# EAGLE design test (EAGLE 6.6.0)
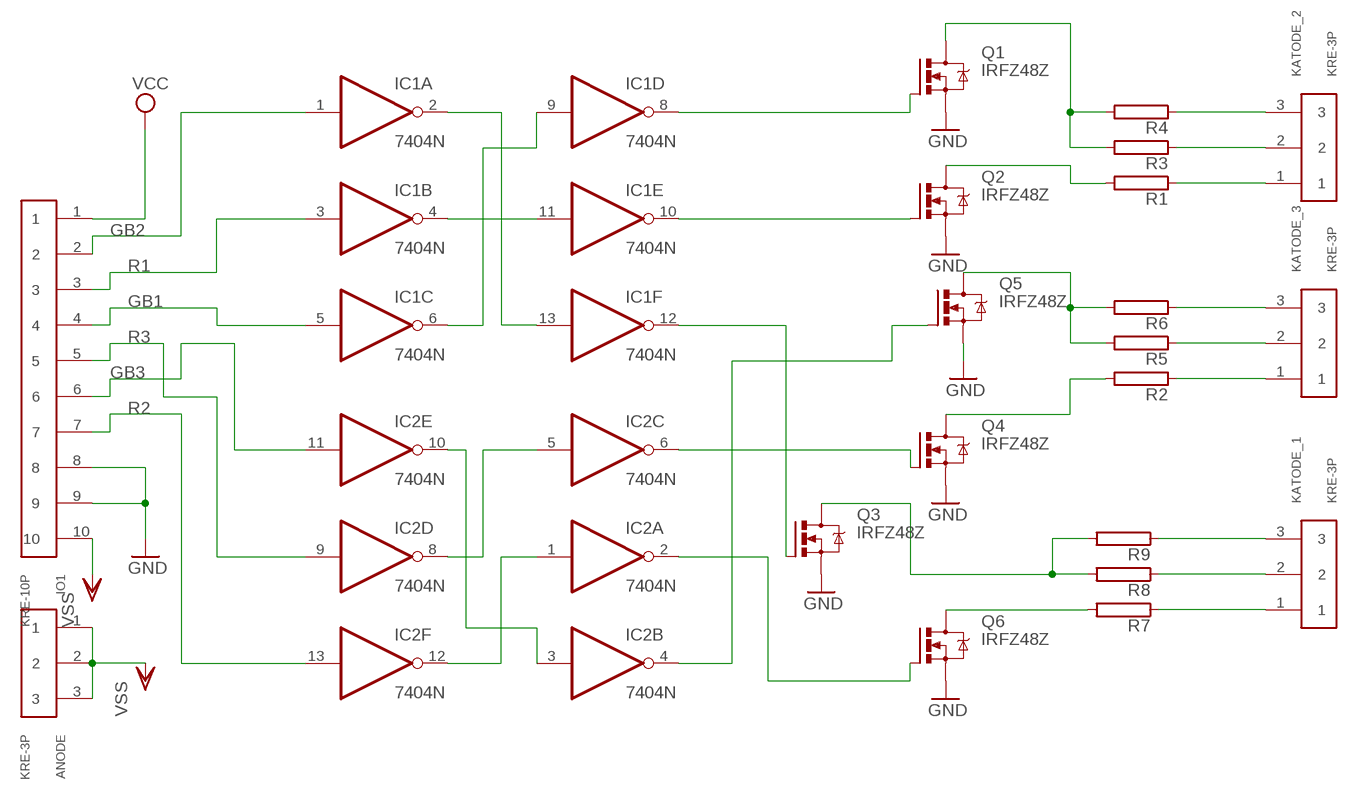
[diagram p0: schematic, sheet 1]

## Parts
ANODE  KRE-3P  [KRE-3P]
IC1  7404N  [DIL14]
IC2  7404N  [DIL14]
IO1  KRE-10P  [KRE-10P]
KATODE_1  KRE-3P  [KRE-3P]
KATODE_2  KRE-3P  [KRE-3P]
KATODE_3  KRE-3P  [KRE-3P]
Q1  IRFZ48Z  [TO220BH]
Q2  IRFZ48Z  [TO220BH]
Q3  IRFZ48Z  [TO220BH]
Q4  IRFZ48Z  [TO220BH]
Q5  IRFZ48Z  [TO220BH]
Q6  IRFZ48Z  [TO220BH]
R1  RAC10  [AC10]
R2  RAC10  [AC10]
R3  RAC10  [AC10]
R4  RAC10  [AC10]
R5  RAC10  [AC10]
R6  RAC10  [AC10]
R7  RAC10  [AC10]
R8  RAC10  [AC10]
R9  RAC10  [AC10]

## Nets
GB1: IC1.5(C:I) IO1.4
GB2: IC1.1(A:I) IO1.2
GB3: IC2.11(E:I) IO1.6
GND: IO1.8 IO1.9 Q1.S Q2.S Q3.S Q4.S Q5.S Q6.S
K_B: Q2.D R1.2
K_B2: Q5.D R5.2 R6.2
K_R: Q1.D R3.2 R4.2
N$1: IC1.8(D:O) Q1.G
N$2: IC1.10(E:O) Q2.G
N$3: KATODE_2.1 R1.1
N$4: IC1.12(F:O) Q3.G
N$5: IC1.4(B:O) IC1.11(E:I)
N$6: IC2.1(A:I) IC2.12(F:O)
N$7: IC2.5(C:I) IC2.8(D:O)
N$8: IC2.6(C:O) Q4.G
N$9: IC2.2(A:O) Q6.G
N$10: IC2.4(B:O) Q5.G
N$11: IC2.3(B:I) IC2.10(E:O)
N$12: IC1.6(C:O) IC1.9(D:I)
N$13: KATODE_2.2 R3.1
N$14: KATODE_2.3 R4.1
N$21: IC1.2(A:O) IC1.13(F:I)
N$22: KATODE_3.1 R2.1
N$23: KATODE_3.2 R5.1
N$24: KATODE_3.3 R6.1
N$25: KATODE_1.1 R7.1
N$26: KATODE_1.2 R8.1
N$27: KATODE_1.3 R9.1
N$28: Q3.D R8.2 R9.2
N$29: Q6.D R7.2
N$30: Q4.D R2.2
R1: IC1.3(B:I) IO1.3
R2: IC2.13(F:I) IO1.7
R3: IC2.9(D:I) IO1.5
VCC: IO1.1
VSS: ANODE.1 ANODE.2 ANODE.3 IO1.10

## Power pins joined to a net without a drawn wire
GND: IC1.7(P:GND) IC2.7(P:GND)
VCC: IC1.14(P:VCC) IC2.14(P:VCC)

## Library data of the parts
ANODE KATODE_1-KATODE_3 = kre:KRE-3P: KRE Conector 3P
IC1 IC2 = 74xx-eu:74*04: Hex INVERTER
IO1 = kre:KRE-10P: KRE Conector 10P
Q1-Q6 = transistor-power:IRFZ48: N Channel HEXFET® Power MOSFET Logic Level Source: http://www.irf.com/product-info/datasheets/data/irfz48z.pdf
R1-R9 = resistor-power:R: Power Resitor; OC_FARNELL: unknown; OC_NEWARK: unknown

## Net classes
0 default: clearance 0.205 mm

## Board
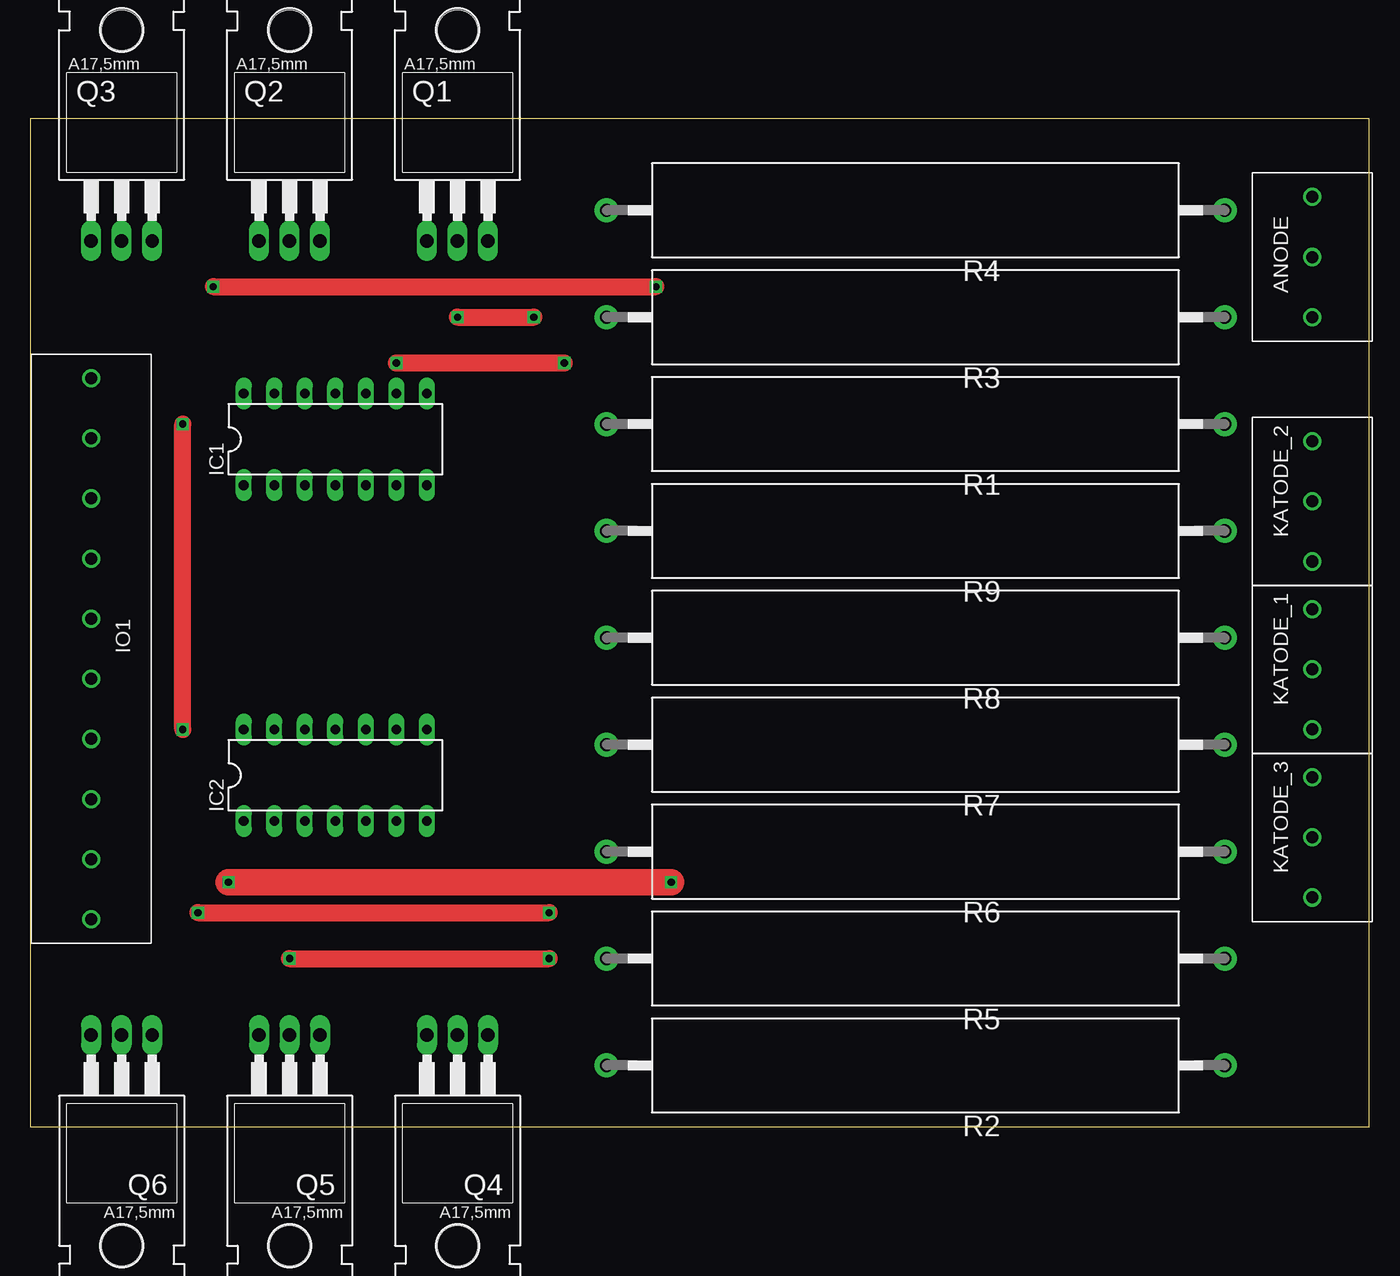
[diagram p1: board, top side]
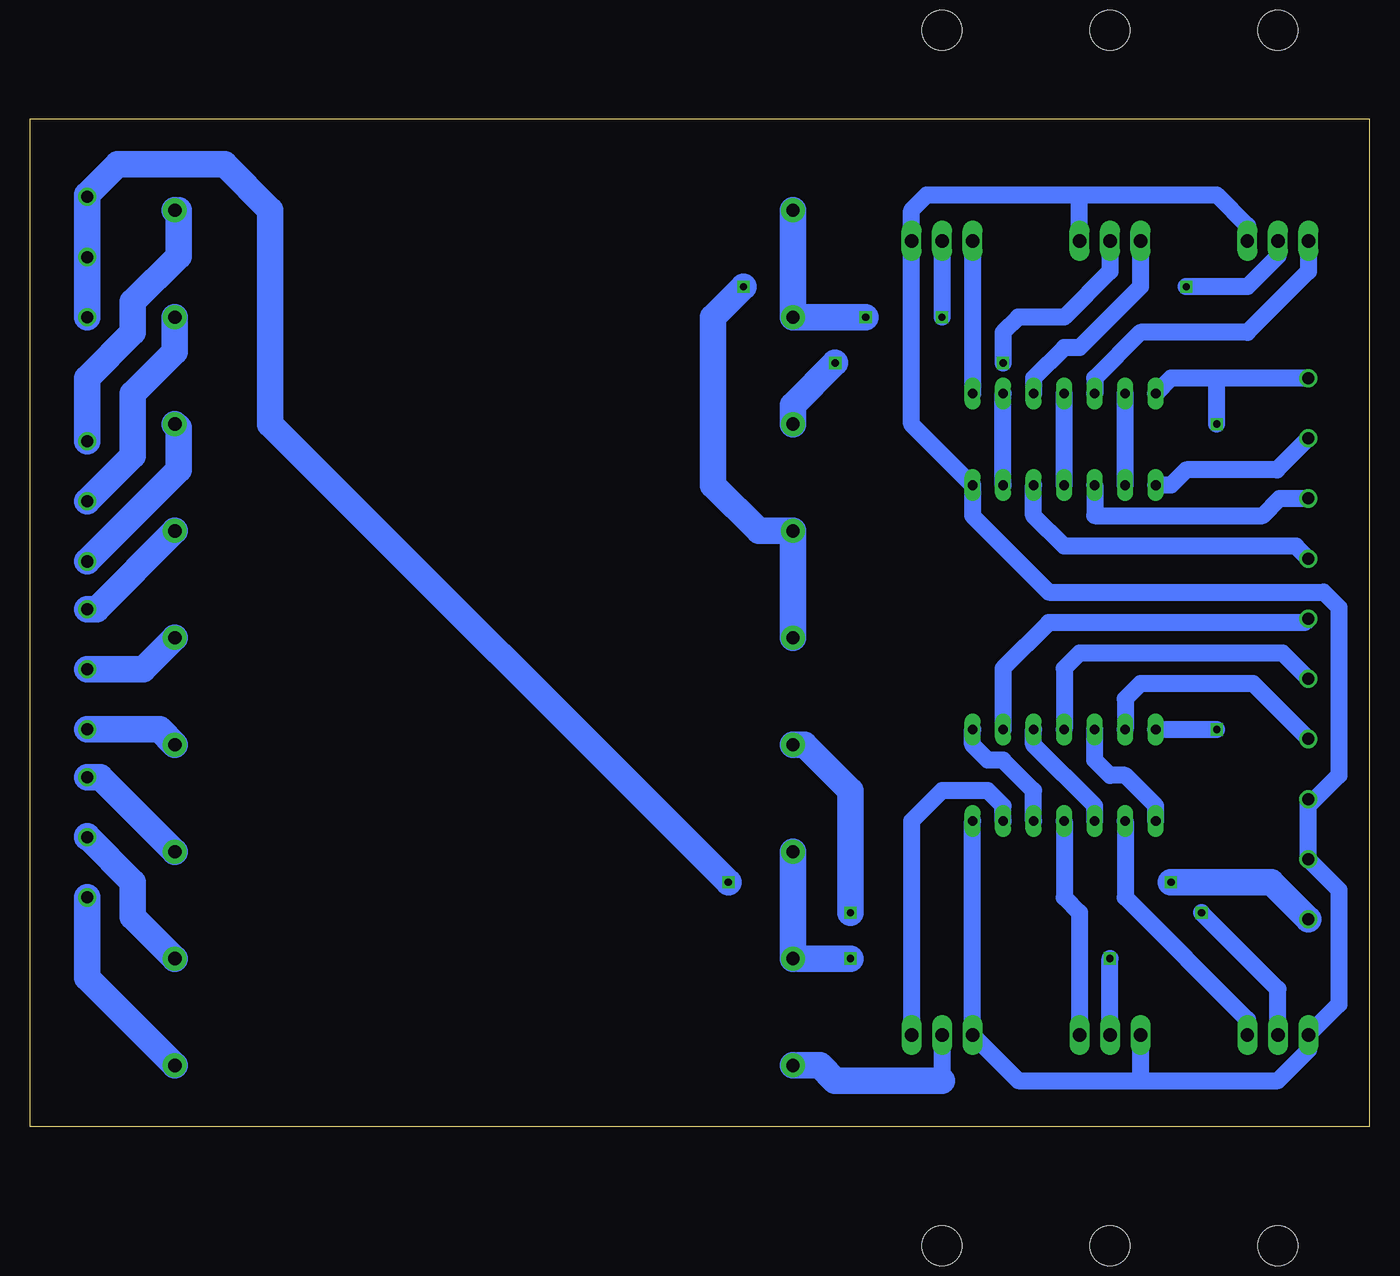
[diagram p2: board, bottom side, seen from below]

Size 111.43 x 83.81 mm. Coordinates in mm from the lower left corner, seen from the top.
Outline: 0,0 111.43,0 111.43,83.81 0,83.81 0,0
Copper layers (1*16): Top 0.035mm / dielectric 1.5mm / Bottom 0.035mm
Design rules "default": minimum track width 10mil, minimum drill 24mil, track to track 8mil, track to pad 8mil, pad to pad 8mil, via to via 8mil, smd to smd 8mil, copper to edge 40mil, drill to drill 8mil, minimum pad ring 10mil, minimum via ring 8mil, stop-mask expansion 4mil, vias tented up to drill 0mil, thermal gap 10mil

### Footprints (pad centres in the part's own frame; a part is rotated, then mirrored left to right if it is on the bottom)
KRE-3P = drill 1: 1 -5.08,0; 2 -0.08,0; 3 4.92,0
DIL14 = drill 0.813 long: 1 -7.62,-3.81; 2 -5.08,-3.81; 3 -2.54,-3.81; 4 0,-3.81; 5 2.54,-3.81; 6 5.08,-3.81; 7 7.62,-3.81; 8 7.62,3.81; 9 5.08,3.81; 10 2.54,3.81; 11 0,3.81; 12 -2.54,3.81; 13 -5.08,3.81; 14 -7.62,3.81
KRE-10P = drill 1: 1 -20.32,0; 2 -15.32,0; 3 -10.32,0; 4 -5.32,0; 5 -0.32,0; 6 4.68,0; 7 9.68,0; 8 14.68,0; 9 19.68,0; 10 24.68,0
TO220BH = drill 1.118 long: D 0,-6.35; G -2.54,-6.35; S 2.54,-6.35 | hole 3.302: 0,11.176
AC10 = drill 1.1 pad 2: 1 -25.725,0; 2 25.7,0

### Placement (x,y rotation side)
ANODE  106.68,72.39 90 top
IC1  25.4,57.15 0 top
IC2  25.4,29.21 0 top
IO1  5.08,41.91 270 top
KATODE_1  106.68,38.1 90 top
KATODE_2  106.68,52.07 90 top
KATODE_3  106.68,24.13 90 top
Q1  35.56,80.01 0 top
Q2  21.59,80.01 0 top
Q3  7.62,80.01 0 top
Q4  35.56,1.27 180 top
Q5  21.59,1.27 180 top
Q6  7.62,1.27 180 top
R1  73.66,58.42 180 top
R2  73.66,5.08 180 top
R3  73.66,67.31 180 top
R4  73.66,76.2 180 top
R5  73.66,13.97 180 top
R6  73.66,22.86 180 top
R7  73.66,31.75 180 top
R8  73.66,40.64 180 top
R9  73.66,49.53 180 top

### Tracks (layer width: path | path; a pad name or v marks a point on that pad's centre or on a via)
GB1
  Bottom 1.422: IO1.4 6.11,48.26 25.4,48.26 27.94,50.8 IC1.5
GB2
  Bottom 1.422: IO1.2 7.7,54.61 15.24,54.61 16.51,53.34 IC1.1
GB3
  Bottom 1.422: IO1.6 7.22,39.37 24.13,39.37 25.4,38.1 IC2.11
GND
  Bottom 1.422: 19.05,3.81 29.21,3.81 Q4.S IC2.7 | 19.05,3.81 7.62,3.81 5.08,6.35 Q6.S 2.54,10.16 2.54,19.69 IO1.9 5.08,26.67 | Q5.S 19.05,3.81 | 5.08,26.67 IO1.8 | 24.13,77.47 36.83,77.47 38.1,76.2 Q1.S 38.1,58.42 IC1.7 33.02,50.8 26.67,44.45 3.81,44.45 2.54,43.18 2.54,29.21 5.08,26.67 | 24.13,77.47 12.7,77.47 10.16,74.93 Q3.S | Q2.S 24.13,77.47
K_B  (via drill 0.6)
  Top 1.422: v30.48,63.5 v44.45,63.5
  Bottom 1.422: Q2.D 21.59,71.12 25.4,67.31 29.21,67.31 30.48,66.04 v30.48,63.5
  Bottom 2.184: v44.45,63.5 47.96,59.99 R1.2
K_B2  (via drill 0.6)
  Top 1.422: v21.59,13.97 v43.18,13.97
  Bottom 1.422: Q5.D v21.59,13.97
  Bottom 2.184: R6.2 R5.2 v43.18,13.97
K_R  (via drill 0.6)
  Top 1.422: v35.56,67.31 v41.91,67.31
  Bottom 1.422: Q1.D v35.56,67.31
  Bottom 2.184: v41.91,67.31 R3.2 R4.2
N$1
  Bottom 1.422: Q1.G IC1.8
N$2
  Bottom 1.422: Q2.G 19.05,69.85 24.13,64.77 25.4,64.77 27.94,62.23 IC1.10
N$3
  Bottom 2.184: R1.1 99.06,58.09 99.06,54.61 KATODE_2.1
N$4
  Bottom 1.422: Q3.G 5.08,71.12 10.16,66.04 19.05,66.04 22.86,62.23 IC1.12
N$5
  Bottom 1.422: IC1.4 IC1.11
N$6
  Bottom 1.422: IC2.1 17.78,26.67 20.32,29.21 21.59,29.21 22.86,30.48 IC2.12
N$7
  Bottom 1.422: IC2.5 27.94,27.94 30.48,30.48 31.75,30.48 33.02,31.75 IC2.8
N$8
  Bottom 1.422: IC2.6 30.48,26.67 31.75,27.94 35.56,27.94 38.1,25.4 Q4.G
N$9
  Bottom 1.422: IC2.2 20.32,19.05 10.16,8.89 Q6.G
N$10
  Bottom 1.422: IC2.4 25.4,19.05 24.13,17.78 Q5.G
N$11
  Bottom 1.422: IC2.3 22.86,26.67 27.94,31.75 IC2.10
N$12
  Bottom 1.422: IC1.6 IC1.9
N$13
  Bottom 2.184: KATODE_2.2 102.87,55.8 102.87,60.96 99.39,64.44 R3.1
N$14
  Bottom 2.184: KATODE_2.3 106.68,62.23 102.87,66.04 102.87,68.58 99.06,72.39 99.06,76.2 R4.1
N$21
  Bottom 1.422: IC1.2 IC1.13
N$22
  Bottom 2.184: R2.1 106.68,12.38 KATODE_3.1
N$23
  Bottom 2.184: R5.1 102.87,17.45 102.87,20.32 106.68,24.13 KATODE_3.2
N$24
  Bottom 2.184: R6.1 105.58,29.05 KATODE_3.3
N$25
  Bottom 2.184: R7.1 100.66,33.02 KATODE_1.1
N$26
  Bottom 2.184: R8.1 102,38.02 KATODE_1.2
N$27
  Bottom 2.184: R9.1 105.89,43.02 KATODE_1.3
N$28  (via drill 0.6)
  Top 1.422: v15.24,69.85 v52.07,69.85
  Bottom 1.422: Q3.D 7.62,72.39 10.16,69.85 v15.24,69.85
  Bottom 2.184: R8.2 R9.2 50.8,49.53 54.61,53.34 54.61,67.31 v52.07,69.85
N$29  (via drill 0.6)
  Top 1.422: v13.97,17.78 v43.18,17.78
  Bottom 1.422: Q6.D 7.62,11.43 v13.97,17.78
  Bottom 2.184: v43.18,17.78 43.18,27.94 46.99,31.75 R7.2
N$30
  Bottom 1.422: Q4.D 35.56,3.81
  Bottom 2.184: 35.56,3.81 44.45,3.81 45.72,5.08 R2.2
R1
  Bottom 1.422: IC1.3 22.86,50.8 8.89,50.8 7.46,52.23 IO1.3
R2
  Bottom 1.422: IO1.7 9.68,36.83 19.05,36.83 20.32,35.56 IC2.13
R3
  Bottom 1.422: IO1.5 5.4,41.91 26.67,41.91 30.48,38.1 IC2.9
VCC  (via drill 0.6)
  Top 1.422: v12.7,33.02 v12.7,58.42
  Bottom 1.422: IO1.1 12.7,62.23 | 12.7,62.23 16.51,62.23 IC1.14 | IC2.14 v12.7,33.02 | v12.7,58.42 12.7,62.23
VSS  (via drill 0.6)
  Top 2.184: v16.51,20.32 v53.34,20.32
  Bottom 2.184: ANODE.1 ANODE.2 ANODE.3 106.68,77.47 104.14,80.01 95.25,80.01 91.44,76.2 91.44,58.42 v53.34,20.32 | IO1.10 8.17,20.32 v16.51,20.32